# Altium project MP3_PCB.PrjPcb
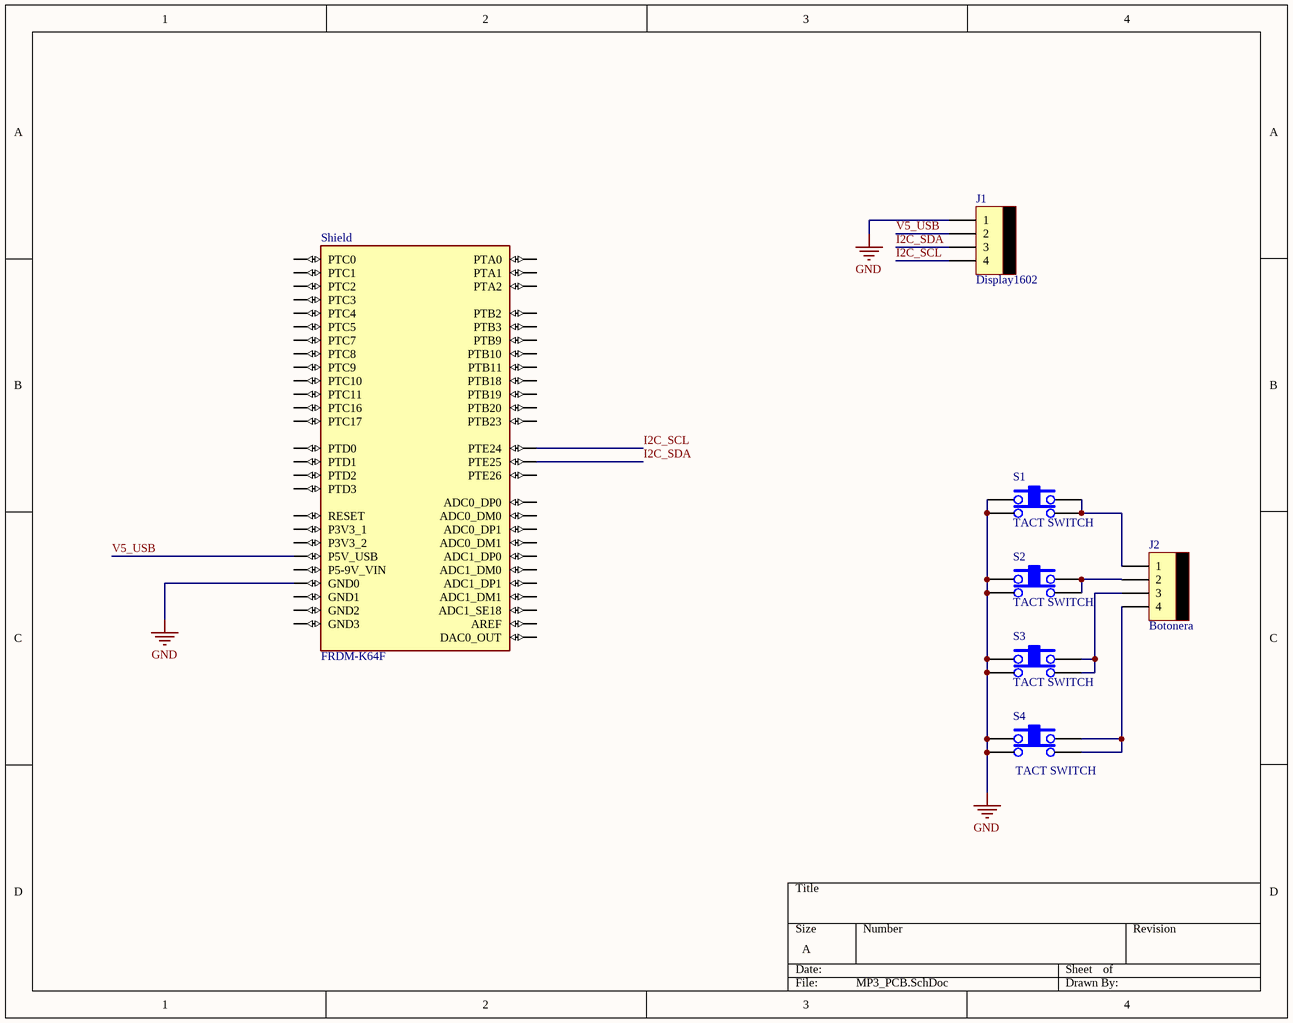
[diagram p0: MP3_PCB.SchDoc]
1 sheet, 7 parts. Net scope: global (net labels, ports and power ports of the same name join across sheets).
Board file: MP3_PCB.PcbDoc

## Sheet MP3_PCB.SchDoc
size A; SheetNumber: 1; SheetTotal: 1

### Parts
J1  Display1602  [MOLEX4]
J2  Botonera  [MOLEX4]
S1  TACT SWITCH  [TACTSWITCH]
S2  TACT SWITCH  [TACTSWITCH]
S3  TACT SWITCH  [TACTSWITCH]
S4  TACT SWITCH  [TACTSWITCH]
Shield  FRDM-K64F  [FRDM-K64F]

### Nets
GND: J1.1 S1.1 S1.2 S2.1 S2.2 S3.1 S3.2 S4.1 S4.2 Shield.J2-3(GND0)
I2C_SCL: J1.4 Shield.J2-20(PTE24)
I2C_SDA: J1.3 Shield.J2-18(PTE25)
V5_USB: J1.2 Shield.J3-10(P5V_USB)
NetJ2_1: J2.1 S1.3 S1.4
NetJ2_2: J2.2 S2.3 S2.4
NetJ2_3: J2.3 S3.3 S3.4
NetJ2_4: J2.4 S4.3 S4.4

Not connected (* = marked no-connect by the designer): Shield J1-1(PTB18) J1-2(PTC16) J1-3(PTB19) J1-4(PTC17) J1-5(PTC1) J1-6(PTB9) J1-7(PTC8) J1-8(PTA1) J1-9(PTC9) J1-10(PTB23) J1-11(PTC0) J1-12(PTA2) J1-13(PTC7) J1-14(PTC2) J1-15(PTC5) J1-16(PTC3) J2-1(PTE26) J2-2(PTA0) J2-4(PTC4) J2-5(ADC0_DP0) J2-6(PTD0) J2-7(ADC0_DM0) J2-8(PTD2) J2-10(PTD3) J2-11(ADC1_DP0) J2-12(PTD1) J2-13(ADC1_DM0) J2-14(GND1) J2-16(AREF) J2-17(ADC1_SE18) J3-4(P3V3_1) J3-6(RESET) J3-8(P3V3_2) J3-12(GND2) J3-14(GND3) J3-16(P5-9V_VIN) J4-1(ADC0_DP1) J4-2(PTB2) J4-3(ADC0_DM1) J4-4(PTB3) J4-5(ADC1_DP1) J4-6(PTB10) J4-7(ADC1_DM1) J4-8(PTB11) J4-9(PTB20) J4-10(PTC11) J4-11(DAC0_OUT) J4-12(PTC10)

### Library data of the parts
J1 J2 = MOLEX4
Shield = FRDM-K64F: K24, K63, K64, mbed-Enabled Development Freedom Kinetis ARMÂ® CortexÂ®-M4 MCU 32-Bit Embedded Evaluation Board; MF: NXP USA; Package: None; Value: *; Price: None; MP: FRDM-K64F; SnapEDA_Link: https://www.snapeda.com/parts/FRDM-K64F/NXP%20USA%20Inc./view-part/508270/?ref=snap; Availability: Unavailable